# Altium project NNLightSwitcher.PrjPcb (part 5 of 5)
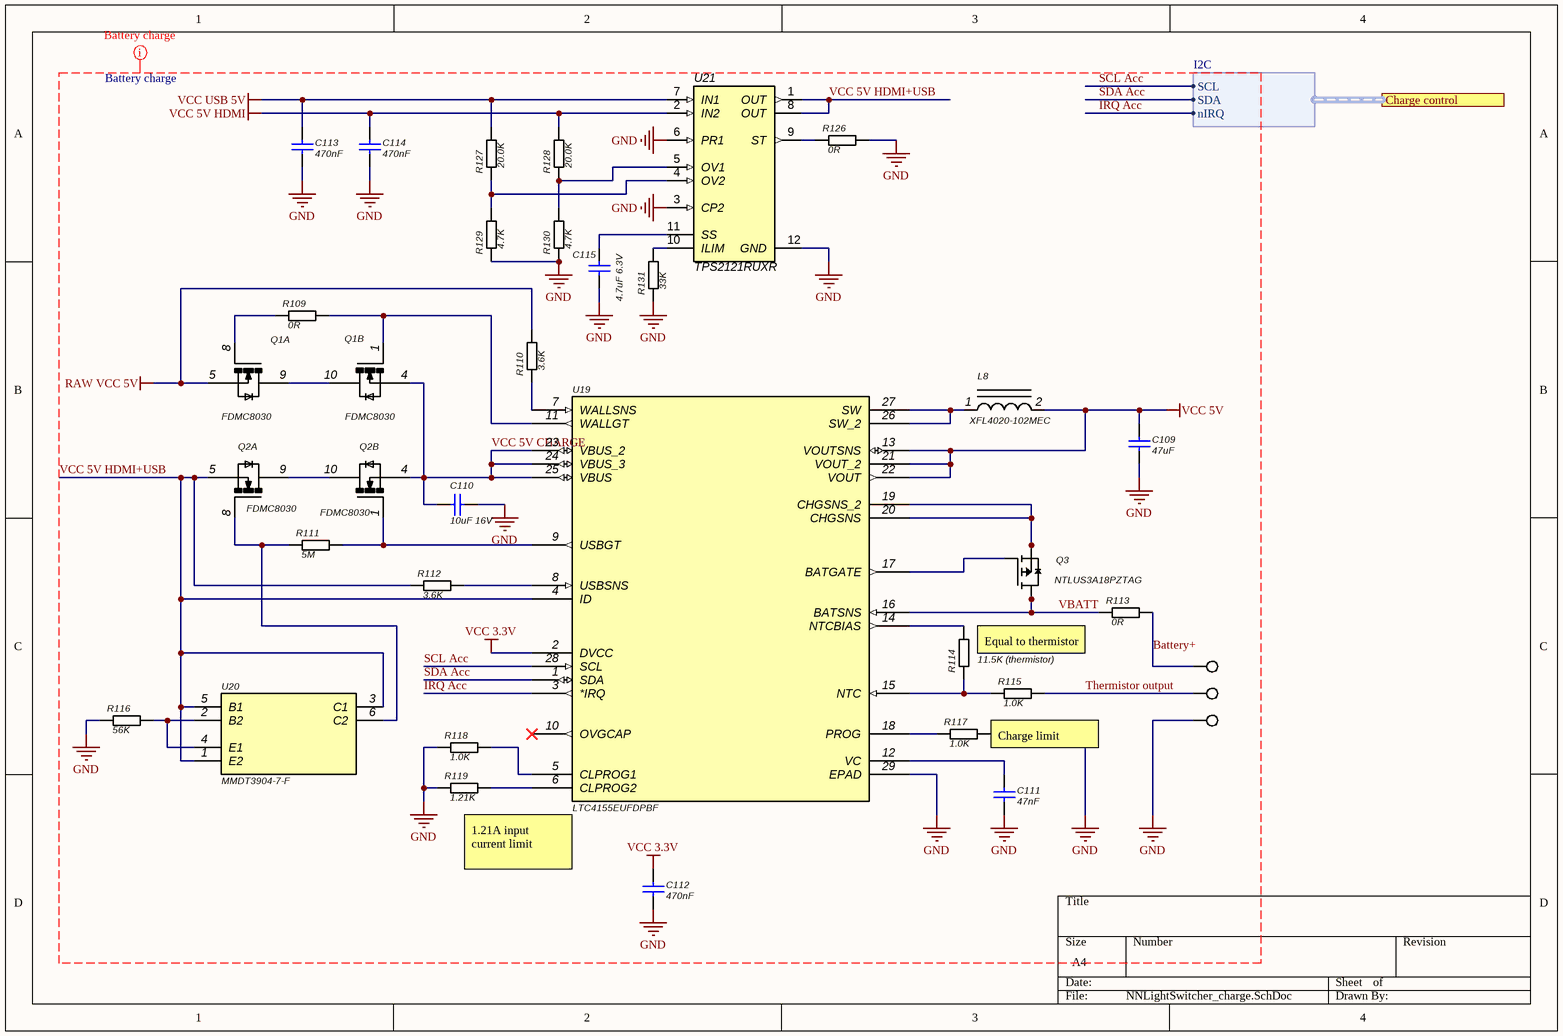
[diagram p13: NNLightSwitcher_charge.SchDoc]

## Nets that join several sheets
AGND: NNLightSwitcher_Zynq (5 pins), NNLightSwitcher_analog (11 pins)
AVCC: NNLightSwitcher_Zynq (C20.1 L3.2 TP2.1 U1.F7), NNLightSwitcher_analog (9 pins)
GND: NNLightSwitcher_Zynq (78 pins), NNLightSwitcher_DDR3 (37 pins), NNLightSwitcher_eMMC_SD (24 pins), NNLightSwitcher_QSPI_Flash (8 pins), NNLightSwitcher_WiFi (C118.2 C119.2 R95.2), NNLightSwitcher_USB (20 pins), NNLightSwitcher_power (33 pins), NNLightSwitcher_connectors (21 pins), NNLightSwitcher_WirelessCharger (R102.2), NNLightSwitcher_charge (20 pins)
RAW VCC 5V: NNLightSwitcher_WirelessCharger (C103.1 U18.4), NNLightSwitcher_charge (Q1.5 R110.2)
SHIELD: NNLightSwitcher_USB (8 pins), NNLightSwitcher_connectors (J7.S1 J7.S2 J7.S3 J7.S4)
VCC 1.0V: NNLightSwitcher_Zynq (15 pins), NNLightSwitcher_power (R32.2 R44.2 TP10.1)
VCC 1.8V: NNLightSwitcher_Zynq (19 pins), NNLightSwitcher_power (R41.2 TP9.1 U6.20)
VCC 1.35V: NNLightSwitcher_Zynq (13 pins), NNLightSwitcher_DDR3 (R22.2), NNLightSwitcher_power (R40.2 TP11.1)
VCC 3.3V: NNLightSwitcher_Zynq (32 pins), NNLightSwitcher_eMMC_SD (R30.1 R31.1), NNLightSwitcher_QSPI_Flash (C69.1 R52.2 U11.8), NNLightSwitcher_WiFi (R93.2), NNLightSwitcher_USB (R53.2), NNLightSwitcher_power (5 pins), NNLightSwitcher_connectors (J4.19 R97.1 R100.1 U17.2), NNLightSwitcher_WirelessCharger (R125.1), NNLightSwitcher_charge (C112.1 U19.2)
VCC 5V: NNLightSwitcher_power (24 pins), NNLightSwitcher_connectors (J4.20 J5.20), NNLightSwitcher_charge (5 pins)
VCC 5V HDMI: NNLightSwitcher_connectors (R124.1), NNLightSwitcher_charge (C114.1 R128.2 U21.2)
VCC USB 5V: NNLightSwitcher_USB (6 pins), NNLightSwitcher_charge (C113.1 R127.2 U21.7)
VTTREF DDR3: NNLightSwitcher_Zynq (5 pins), NNLightSwitcher_DDR3 (C40.2 C41.1 U4.H1 U4.M8)
A0 DDR3: NNLightSwitcher_Zynq (U1.P1), NNLightSwitcher_DDR3 (RN3.8)
A1 DDR3: NNLightSwitcher_Zynq (U1.N1), NNLightSwitcher_DDR3 (RN1.13)
A2 DDR3: NNLightSwitcher_Zynq (U1.M1), NNLightSwitcher_DDR3 (RN2.2)
A3 DDR3: NNLightSwitcher_Zynq (U1.M4), NNLightSwitcher_DDR3 (RN2.1)
A4 DDR3: NNLightSwitcher_Zynq (U1.P3), NNLightSwitcher_DDR3 (RN1.12)
A5 DDR3: NNLightSwitcher_Zynq (U1.P4), NNLightSwitcher_DDR3 (RN2.3)
A6 DDR3: NNLightSwitcher_Zynq (U1.P5), NNLightSwitcher_DDR3 (RN1.14)
A7 DDR3: NNLightSwitcher_Zynq (U1.M5), NNLightSwitcher_DDR3 (RN2.5)
A8 DDR3: NNLightSwitcher_Zynq (U1.P6), NNLightSwitcher_DDR3 (RN1.15)
A9 DDR3: NNLightSwitcher_Zynq (U1.N4), NNLightSwitcher_DDR3 (RN2.4)
A10 DDR3: NNLightSwitcher_Zynq (U1.J1), NNLightSwitcher_DDR3 (RN2.10)
A11 DDR3: NNLightSwitcher_Zynq (U1.L2), NNLightSwitcher_DDR3 (RN1.16)
A12 DDR3: NNLightSwitcher_Zynq (U1.M2), NNLightSwitcher_DDR3 (RN1.11)
A13 DDR3: NNLightSwitcher_Zynq (U1.K2), NNLightSwitcher_DDR3 (RN2.6)
A14 DDR3: NNLightSwitcher_Zynq (U1.K1), NNLightSwitcher_DDR3 (RN2.9)
AD0_N: NNLightSwitcher_Zynq (U1.E13), NNLightSwitcher_connectors (J4.7)
AD0_P: NNLightSwitcher_Zynq (U1.F12), NNLightSwitcher_connectors (J4.6)
AD1_N: NNLightSwitcher_Zynq (U1.F14), NNLightSwitcher_connectors (J4.4)
AD1_P: NNLightSwitcher_Zynq (U1.F13), NNLightSwitcher_connectors (J4.5)
AD8_N: NNLightSwitcher_Zynq (U1.E12), NNLightSwitcher_analog (R16.2 TP5.1 U3.6)
AD8_P: NNLightSwitcher_Zynq (U1.E11), NNLightSwitcher_analog (R13.2 TP3.1 U3.9)
AD9_N: NNLightSwitcher_Zynq (U1.F15), NNLightSwitcher_connectors (J4.2)
AD9_P: NNLightSwitcher_Zynq (U1.G15), NNLightSwitcher_connectors (J4.3)
Audio_N: NNLightSwitcher_Zynq (U1.H8), NNLightSwitcher_connectors (J5.18)
Audio_P: NNLightSwitcher_Zynq (U1.G7), NNLightSwitcher_connectors (J5.17)
BA0 DDR3: NNLightSwitcher_Zynq (U1.M6), NNLightSwitcher_DDR3 (RN3.7)
BA1 DDR3: NNLightSwitcher_Zynq (U1.R1), NNLightSwitcher_DDR3 (RN1.10)
BA2 DDR3: NNLightSwitcher_Zynq (U1.N6), NNLightSwitcher_DDR3 (RN3.6)
Batt charge SCL: NNLightSwitcher_Zynq (U2.10), NNLightSwitcher_charge (U19.28)
Batt charge SDA: NNLightSwitcher_Zynq (U2.9), NNLightSwitcher_charge (U19.1)
BT_DEV_WAKE: NNLightSwitcher_Zynq (U1.N12), NNLightSwitcher_WiFi (R78.1 R80.2 TP28.1 U13.40)
BT_HOST_WAKE: NNLightSwitcher_Zynq (U1.N13), NNLightSwitcher_WiFi (R79.1 R81.2 TP29.1 U13.41)
BT_REG_ON: NNLightSwitcher_Zynq (U1.K11), NNLightSwitcher_WiFi (R94.1)
CK DDR3_N: NNLightSwitcher_Zynq (U1.N2), NNLightSwitcher_DDR3 (R20.1 U4.K7)
CK DDR3_P: NNLightSwitcher_Zynq (U1.N3), NNLightSwitcher_DDR3 (R20.2 U4.J7)
CKE DDR3: NNLightSwitcher_Zynq (U1.L3), NNLightSwitcher_DDR3 (R18.1 U4.K9)
CLK qSPI Flash: NNLightSwitcher_Zynq (U1.A10), NNLightSwitcher_QSPI_Flash (R45.1)
CLK SDIO Zync: NNLightSwitcher_Zynq (U1.B7), NNLightSwitcher_eMMC_SD (RN25.11 RN26.14)
CMD SDIO Zync: NNLightSwitcher_Zynq (U1.B10), NNLightSwitcher_eMMC_SD (RN25.14 RN26.11)
DAT0 SDIO Zync: NNLightSwitcher_Zynq (U1.D6), NNLightSwitcher_eMMC_SD (RN25.9 RN26.16)
DAT1 SDIO Zync: NNLightSwitcher_Zynq (U1.C6), NNLightSwitcher_eMMC_SD (RN25.10 RN26.15)
DAT2 SDIO Zync: NNLightSwitcher_Zynq (U1.B9), NNLightSwitcher_eMMC_SD (RN25.12 RN26.13)
DAT3 SDIO Zync: NNLightSwitcher_Zynq (U1.D10), NNLightSwitcher_eMMC_SD (RN25.13 RN26.12)
DML DDR3: NNLightSwitcher_Zynq (U1.B1), NNLightSwitcher_DDR3 (U4.E7)
DMU DDR3: NNLightSwitcher_Zynq (U1.D3), NNLightSwitcher_DDR3 (U4.D3)
DQL0 DDR3: NNLightSwitcher_Zynq (U1.D4), NNLightSwitcher_DDR3 (U4.E3)
DQL1 DDR3: NNLightSwitcher_Zynq (U1.A2), NNLightSwitcher_DDR3 (U4.F7)
DQL2 DDR3: NNLightSwitcher_Zynq (U1.C4), NNLightSwitcher_DDR3 (U4.F2)
DQL3 DDR3: NNLightSwitcher_Zynq (U1.C1), NNLightSwitcher_DDR3 (U4.F8)
DQL4 DDR3: NNLightSwitcher_Zynq (U1.B4), NNLightSwitcher_DDR3 (U4.H3)
DQL5 DDR3: NNLightSwitcher_Zynq (U1.A4), NNLightSwitcher_DDR3 (U4.H8)
DQL6 DDR3: NNLightSwitcher_Zynq (U1.C3), NNLightSwitcher_DDR3 (U4.G2)
DQL7 DDR3: NNLightSwitcher_Zynq (U1.A3), NNLightSwitcher_DDR3 (U4.H7)
DQSL DDR3_N: NNLightSwitcher_Zynq (U1.B2), NNLightSwitcher_DDR3 (U4.G3)
DQSL DDR3_P: NNLightSwitcher_Zynq (U1.C2), NNLightSwitcher_DDR3 (U4.F3)
DQSU DDR3_N: NNLightSwitcher_Zynq (U1.F2), NNLightSwitcher_DDR3 (U4.B7)
DQSU DDR3_P: NNLightSwitcher_Zynq (U1.G2), NNLightSwitcher_DDR3 (U4.C7)
DQU0 DDR3: NNLightSwitcher_Zynq (U1.E1), NNLightSwitcher_DDR3 (U4.D7)
DQU1 DDR3: NNLightSwitcher_Zynq (U1.D1), NNLightSwitcher_DDR3 (U4.C3)
DQU2 DDR3: NNLightSwitcher_Zynq (U1.E2), NNLightSwitcher_DDR3 (U4.C8)
DQU3 DDR3: NNLightSwitcher_Zynq (U1.E3), NNLightSwitcher_DDR3 (U4.C2)
DQU4 DDR3: NNLightSwitcher_Zynq (U1.F3), NNLightSwitcher_DDR3 (U4.A7)
DQU5 DDR3: NNLightSwitcher_Zynq (U1.G1), NNLightSwitcher_DDR3 (U4.A2)
DQU6 DDR3: NNLightSwitcher_Zynq (U1.H1), NNLightSwitcher_DDR3 (U4.B8)
DQU7 DDR3: NNLightSwitcher_Zynq (U1.H2), NNLightSwitcher_DDR3 (U4.A3)
External SCL: NNLightSwitcher_Zynq (U2.12), NNLightSwitcher_connectors (J5.15)
External SDA: NNLightSwitcher_Zynq (U2.11), NNLightSwitcher_connectors (J5.16)
GPIO2: NNLightSwitcher_Zynq (U1.K15), NNLightSwitcher_connectors (J5.5)
GPIO3: NNLightSwitcher_Zynq (U1.J14), NNLightSwitcher_connectors (J5.3)
GPIO4: NNLightSwitcher_Zynq (U1.H12), NNLightSwitcher_connectors (J5.9)
GPIO5: NNLightSwitcher_Zynq (U1.N14), NNLightSwitcher_connectors (J4.16)
GPIO6: NNLightSwitcher_Zynq (U1.R15), NNLightSwitcher_connectors (J4.15)
GPIO7: NNLightSwitcher_Zynq (U1.L14), NNLightSwitcher_connectors (J5.6)
GPIO8: NNLightSwitcher_Zynq (U1.L15), NNLightSwitcher_connectors (R123.2 TP65.1)
GPIO9: NNLightSwitcher_Zynq (U1.J13), NNLightSwitcher_connectors (J5.12), NNLightSwitcher_charge (U19.3)
GPIO10: NNLightSwitcher_Zynq (U1.H14), NNLightSwitcher_connectors (J5.2)
GPIO11: NNLightSwitcher_Zynq (U1.J15), NNLightSwitcher_connectors (J5.4)
GPIO12: NNLightSwitcher_Zynq (U1.M15), NNLightSwitcher_connectors (R121.2 TP63.1)
GPIO13: NNLightSwitcher_Zynq (U1.R13), NNLightSwitcher_connectors (J4.13)
GPIO14: NNLightSwitcher_Zynq (U1.M12), NNLightSwitcher_WiFi (TP22.1 U13.47)
GPIO16: NNLightSwitcher_Zynq (U1.L13), NNLightSwitcher_WiFi (R96.1)
GPIO17: NNLightSwitcher_Zynq (U1.G11), NNLightSwitcher_connectors (J5.10)
GPIO18: NNLightSwitcher_Zynq (U1.H11), NNLightSwitcher_connectors (J5.11)
GPIO19: NNLightSwitcher_Zynq (U1.R12), NNLightSwitcher_connectors (J4.12)
GPIO20: NNLightSwitcher_Zynq (U1.M14), NNLightSwitcher_connectors (TP64.1)
GPIO21: NNLightSwitcher_Zynq (U1.P15), NNLightSwitcher_connectors (J4.18)
GPIO22: NNLightSwitcher_Zynq (U1.H13), NNLightSwitcher_connectors (J5.8)
GPIO23: NNLightSwitcher_Zynq (U1.J11), NNLightSwitcher_USB (R59.2), NNLightSwitcher_connectors (J5.13)
GPIO25: NNLightSwitcher_Zynq (U1.K13), NNLightSwitcher_USB (R60.2), NNLightSwitcher_connectors (J5.14)
GPIO26: NNLightSwitcher_Zynq (U1.L12), NNLightSwitcher_WiFi (TP21.1 U13.48)
GPIO27: NNLightSwitcher_Zynq (U1.G12), NNLightSwitcher_connectors (J5.7)
GPIO_PL_0: NNLightSwitcher_Zynq (U1.N11), NNLightSwitcher_connectors (J4.8)
GPIO_PL_2: NNLightSwitcher_Zynq (U1.P13), NNLightSwitcher_connectors (J4.14)
GPIO_PL_3: NNLightSwitcher_Zynq (U1.P14), NNLightSwitcher_connectors (J4.17)
GPIO_PL_4: NNLightSwitcher_Zynq (U1.M9), NNLightSwitcher_connectors (J4.10)
GPIO_PL_5: NNLightSwitcher_Zynq (U1.N9), NNLightSwitcher_connectors (J4.11)
GPIO_PL_6: NNLightSwitcher_Zynq (U1.M10), NNLightSwitcher_connectors (J4.9)
GPIO_PL_7: NNLightSwitcher_Zynq (U1.M11), NNLightSwitcher_connectors (TP50.1)
GPIO_PL_8: NNLightSwitcher_Zynq (U1.N7), NNLightSwitcher_connectors (TP67.1)
GPIO_PL_9: NNLightSwitcher_Zynq (U1.N8), NNLightSwitcher_connectors (TP70.1)
HDMI SCL: NNLightSwitcher_Zynq (U2.7), NNLightSwitcher_connectors (J7.15)
HDMI SDA: NNLightSwitcher_Zynq (U2.6), NNLightSwitcher_connectors (J7.16)
HDMI_CEC: NNLightSwitcher_Zynq (U1.K12), NNLightSwitcher_connectors (FB1.1)
HDMI_IRQ: NNLightSwitcher_Zynq (U1.D8), NNLightSwitcher_connectors (J7.19 R98.2)
HDMI_TX0_N: NNLightSwitcher_Zynq (U1.P8), NNLightSwitcher_connectors (U16.1)
HDMI_TX0_P: NNLightSwitcher_Zynq (U1.P9), NNLightSwitcher_connectors (U16.2)
HDMI_TX1_N: NNLightSwitcher_Zynq (U1.R10), NNLightSwitcher_connectors (U15.4)
HDMI_TX1_P: NNLightSwitcher_Zynq (U1.P10), NNLightSwitcher_connectors (U15.5)
HDMI_TX2_N: NNLightSwitcher_Zynq (U1.R11), NNLightSwitcher_connectors (U16.4)
HDMI_TX2_P: NNLightSwitcher_Zynq (U1.P11), NNLightSwitcher_connectors (U16.5)
HDMI_TXC_N: NNLightSwitcher_Zynq (U1.R7), NNLightSwitcher_connectors (U15.1)
HDMI_TXC_P: NNLightSwitcher_Zynq (U1.R8), NNLightSwitcher_connectors (U15.2)
IO0 qSPI Flash: NNLightSwitcher_Zynq (U1.A8), NNLightSwitcher_QSPI_Flash (R48.1 U11.5)
IO1 qSPI Flash: NNLightSwitcher_Zynq (U1.A7), NNLightSwitcher_QSPI_Flash (R49.1 U11.2)
IO2 qSPI Flash: NNLightSwitcher_Zynq (U1.C8), NNLightSwitcher_QSPI_Flash (R50.1 U11.3)
IO3 qSPI Flash: NNLightSwitcher_Zynq (U1.A9), NNLightSwitcher_QSPI_Flash (R51.1 U11.7)
MIO9: NNLightSwitcher_Zynq (U1.B5), NNLightSwitcher_connectors (TP51.1)
MIO34: NNLightSwitcher_Zynq (U1.D15), NNLightSwitcher_connectors (R120.2 TP52.1)
MIO35: NNLightSwitcher_Zynq (U1.A14), NNLightSwitcher_connectors (R122.2 TP53.1)
MIO36: NNLightSwitcher_Zynq (U1.B14), NNLightSwitcher_connectors (TP54.1)
MIO37: NNLightSwitcher_Zynq (U1.C14), NNLightSwitcher_connectors (TP55.1)
nCAS DDR3: NNLightSwitcher_Zynq (U1.R5), NNLightSwitcher_DDR3 (RN3.2)
nCS DDR3: NNLightSwitcher_Zynq (U1.R2), NNLightSwitcher_DDR3 (RN3.5)
nCS qSPI Flash: NNLightSwitcher_Zynq (U1.A5), NNLightSwitcher_QSPI_Flash (R47.1 U11.1)
nMRST: NNLightSwitcher_Zynq (U2.3), NNLightSwitcher_eMMC_SD (RN25.16), NNLightSwitcher_power (R35.1 R36.2 U7.3), NNLightSwitcher_connectors (J6.10)
nRAS DDR3: NNLightSwitcher_Zynq (U1.R6), NNLightSwitcher_DDR3 (RN3.1)
nRST DDR3: NNLightSwitcher_Zynq (U1.L4), NNLightSwitcher_DDR3 (R19.1 U4.T2)
nWE DDR3: NNLightSwitcher_Zynq (U1.R3), NNLightSwitcher_DDR3 (RN3.4)
ODT DDR3: NNLightSwitcher_Zynq (U1.K3), NNLightSwitcher_DDR3 (RN3.3)
POR_B: NNLightSwitcher_Zynq (U1.C9), NNLightSwitcher_power (R33.1 TP7.1 U7.1 U7.5)
SDIO CLK WiFi: NNLightSwitcher_Zynq (U1.A15), NNLightSwitcher_WiFi (RN27.16)
SDIO CMD WiFi: NNLightSwitcher_Zynq (U1.D11), NNLightSwitcher_WiFi (RN27.13)
SDIO DAT0 WiFi: NNLightSwitcher_Zynq (U1.B15), NNLightSwitcher_WiFi (RN27.15)
SDIO DAT1 WiFi: NNLightSwitcher_Zynq (U1.C12), NNLightSwitcher_WiFi (RN27.11)
SDIO DAT2 WiFi: NNLightSwitcher_Zynq (U1.E15), NNLightSwitcher_WiFi (RN27.14)
SDIO DAT3 WiFi: NNLightSwitcher_Zynq (U1.C11), NNLightSwitcher_WiFi (RN27.12)
TCK Zynq: NNLightSwitcher_Zynq (U1.G9), NNLightSwitcher_connectors (J6.4)
TDI Zynq: NNLightSwitcher_Zynq (U1.L7), NNLightSwitcher_connectors (J6.8)
TDO Zynq: NNLightSwitcher_Zynq (U1.L8), NNLightSwitcher_connectors (J6.6)
TMS Zynq: NNLightSwitcher_Zynq (U1.L9), NNLightSwitcher_connectors (J6.2)
UART RXD BLE: NNLightSwitcher_Zynq (U1.C13), NNLightSwitcher_WiFi (TP24.1 U13.45)
UART RXD USB: NNLightSwitcher_Zynq (U1.A13), NNLightSwitcher_USB (R54.2)
UART TXD BLE: NNLightSwitcher_Zynq (U1.A12), NNLightSwitcher_WiFi (TP23.1 U13.46)
UART TXD USB: NNLightSwitcher_Zynq (U1.D14), NNLightSwitcher_USB (R55.2)

## Assembly variants
BGA place: not fitted C1 C2 C3 C4 C5 C6 C7 C8 C9 C10 C11 C12 C13 C14 C15 C16 C17 C18 C19 C20 C21 C22 C23 C24 C25 C26 C27 C28 C29 C30 C31 C32 C33 C34 C35 C36 C37 C38 C39 C40 C41 C42 C43 C44 C45 C46 C47 C48 C49 C50 C51 C52 C53 C54 C55 C56 C57 C58 C59 C60 C61 C62 C63 C64 C65 C66 C67 C68 C69 C70 C71 C72 C73 C74 C75 C76 C77 C81 C82 C83 C84 C85 C86 C89 C90 C91 C92 C93 C94 C95 C96 C97 C98 C99 C100 C101 C102 C103 C104 C105 C106 C107 C108 C109 C110 C111 C112 C113 C114 C115 C118 C119 D1 D2 D3 D4 D5 D6 D7 D8 E1 FB1 J1 J2 J3 J4 J5 J6 J7 L1 L2 L3 L4 L5 L7 L8 MK1 MK2 Q1 Q2 Q3 R1 R2 R3 R4 R5 R6 R7 R8 R9 R10 R11 R12 R13 R14 R15 R16 R17 R18 R19 R20 R21 R22 R23 R24 R25 R26 R28 R29 R30 R31 R32 R33 R34 R35 R36 R37 R38 R39 R40 R41 R42 R43 R44 R45 R46 R47 R48 R49 R50 R51 R52 R53 R54 R55 R56 R57 R58 R59 R60 R61 R62 R63 R67 R68 R69 R70 R71 R73 R74 R75 R76 R77 R78 R79 R80 R81 R82 R83 R84 R85 R86 R87 R88 R89 R90 R91 R92 R93 R94 R95 R96 R97 R98 R99 R100 R101 R102 R103 R104 R105 R106 R107 R108 R109 R110 R111 R112 R113 R114 R115 R116 R117 R118 R119 R120 R121 R122 R123 R124 R125 R126 R127 R128 R129 R130 R131 RN1 RN2 RN3 RN25 RN26 RN27 S1 Shield1 TP1 TP2 TP3 TP4 TP5 TP6 TP7 TP8 TP9 TP10 TP11 TP12 TP13 TP14 TP15 TP16 TP17 TP18 TP19 TP20 TP21 TP22 TP23 TP24 TP25 TP26 TP27 TP28 TP29 TP30 TP31 TP32 TP33 TP34 TP35 TP36 TP37 TP38 TP39 TP40 TP41 TP42 TP43 TP44 TP45 TP46 TP47 TP48 TP49 TP50 TP51 TP52 TP53 TP54 TP55 TP56 TP57 TP58 TP59 TP60 TP61 TP62 TP63 TP64 TP65 TP66 TP67 TP70 TP71 TP72 U2 U3 U6 U7 U8 U9 U10 U11 U12 U14 U15 U16 U17 U18 U19 U20 U21 VD1 Y1